# Altium schematic sheet Sheet1.SchDoc
size A4; SheetNumber: 1; SheetTotal: 1
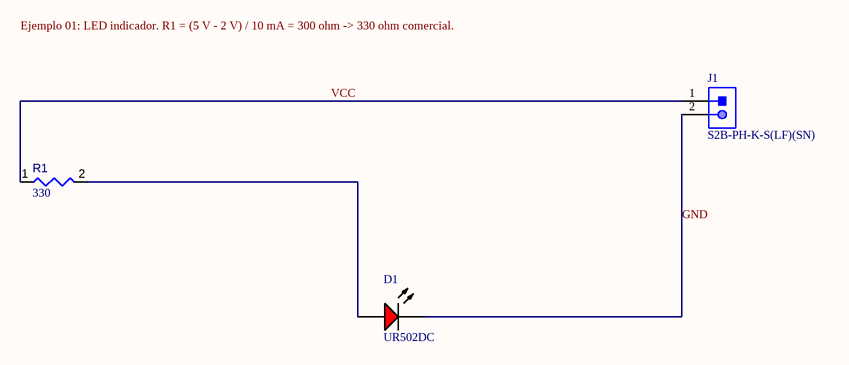
[diagram p0: Sheet1.SchDoc]

## Parts
D1  UR502DC  [CGX-UR502DC]
J1  S2B-PH-K-S(LF)(SN)  [JST-S2B-PH-K-S_V]
R1  value 330  [RESC0402(1005)_L]  (hidden comment: Resistor 330R +/-5 % 0402 63 mW)

## Nets
GND: D1.2(K) J1.2
VCC: J1.1 R1.1
NetD1_1: D1.1(A) R1.2

## Notes on the sheet
- Ejemplo 01: LED indicador. R1 = (5 V - 2 V) / 10 mA = 300 ohm -> 330 ohm comercial.

## Library data of the parts
D1 = CMP-007-00009-2: Red LED, 80 mW, 30 mA, -25 to 85 degC, 2-Pin THD; Manufacturer: Shenzhen CGX; Power: 80mW; Case/Package: UR502DC; RoHS Compliant: Unknown; Package Description: 2-Pin Through Hole Device, Dia 5.9 mm, Height 9.1 mm; Manufacturer URL: http://szcgx.com/; Datasheet Version: Sep-14; Package Reference: UR502DC; Datasheet URL: http://datasheet.octopart.com/UR502DC-Chengguangxing-datasheet-62330342.pdf; Mounting Technology: TH
J1 = CMP-002-00030-2: Male Header, Pitch 2 mm, 1 x 2 Position, Height 4.8 mm, Tail Length 3.4 mm, -25 to 85 degC, RoHS, Bulk; Manufacturer: Japan Solderless Terminals; Package Reference: S2B-PH-K-S; Case/Package: S2B-PH-K-S; Datasheet URL: http://www.jst-mfg.com/product/pdf/eng/ePH.pdf; RoHS Compliant: Unknown; Datasheet Version: Dec-12; Gender: Male; Min Operating Temperature: -25°C; Max Operating Temperature: 85°C; Package Description: Male Header, Pitch 2 mm, 1 x 2 Position, Height 4.8 mm, Tail Length 3.4 mm; Connector Type: Header; Mounting Technology: SM
R1 = CMP-009-00132-3: Chip Resistor, 330 Ohms, +/-5 %, 63 mW, -55 to 155 degC, 0402; Power: 63mW; Tolerance: 5%; Pins: 2; Max Operating Temperature: 155°C; Min Operating Temperature: -55°C; Case/Package: 0402